# Altium schematic sheet BSU_Sensing.SchDoc: Sensing
size A4; Sub Team: EEE; Organization: PERT; SheetNumber: 5; SheetTotal: 8
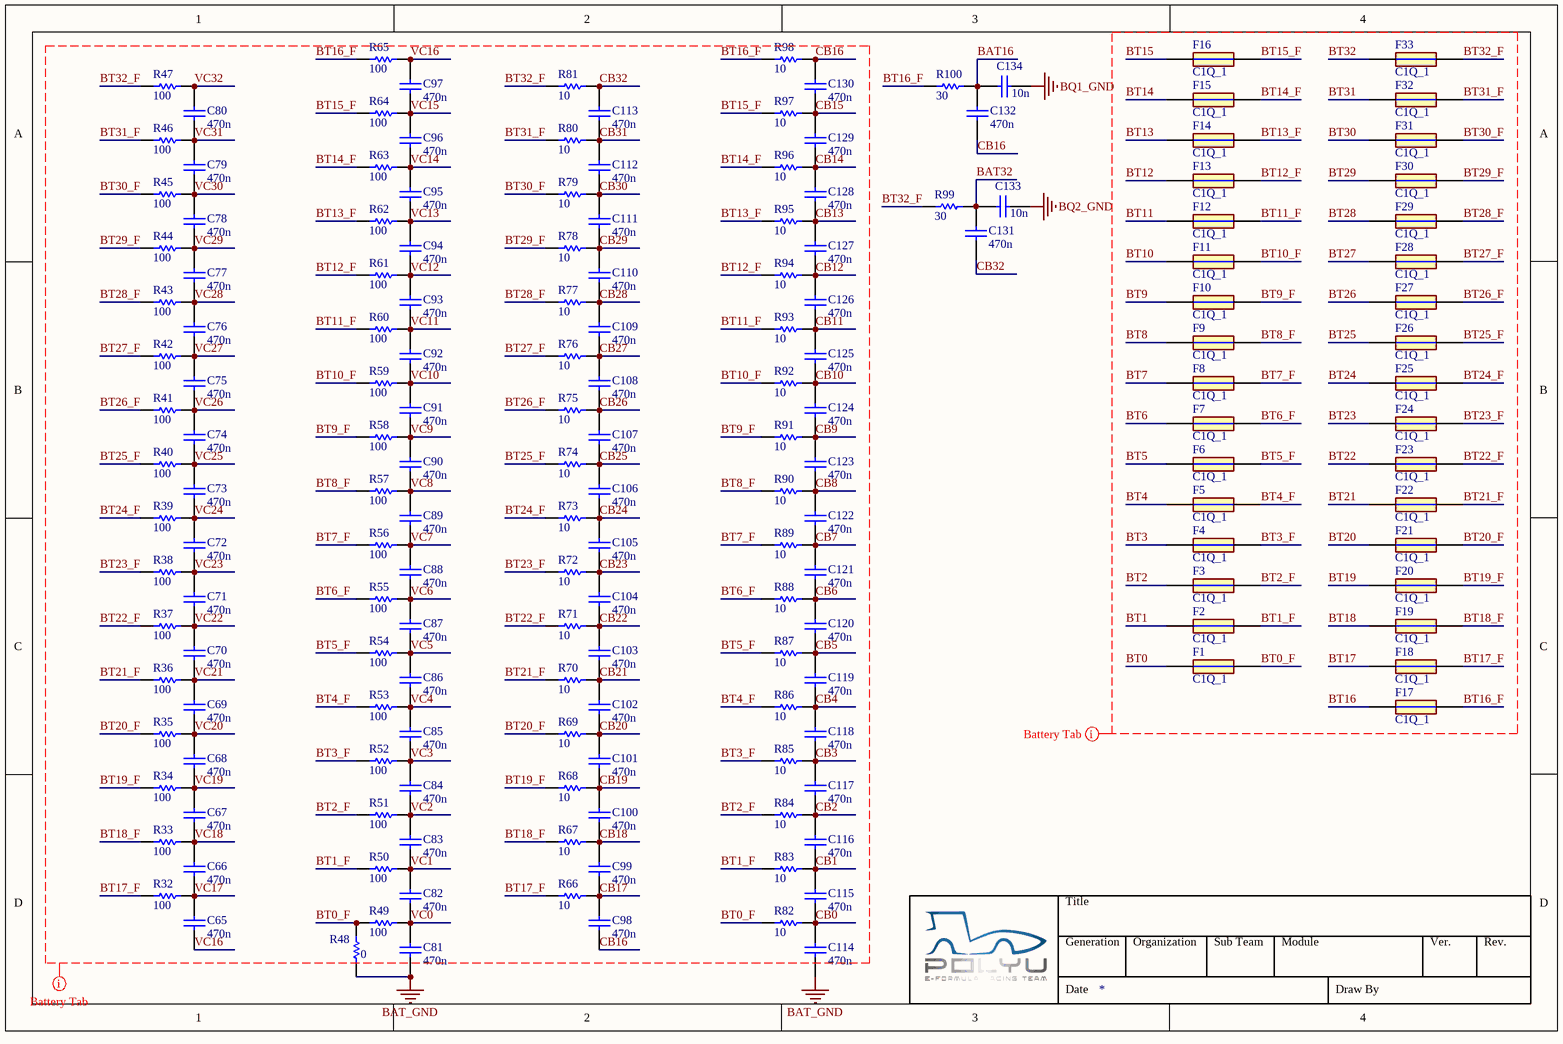
[diagram p0: BSU_Sensing.SchDoc]

## Parts
C65  470n  [0603_SMD_C]
C66  470n  [0603_SMD_C]
C67  470n  [0603_SMD_C]
C68  470n  [0603_SMD_C]
C69  470n  [0603_SMD_C]
C70  470n  [0603_SMD_C]
C71  470n  [0603_SMD_C]
C72  470n  [0603_SMD_C]
C73  470n  [0603_SMD_C]
C74  470n  [0603_SMD_C]
C75  470n  [0603_SMD_C]
C76  470n  [0603_SMD_C]
C77  470n  [0603_SMD_C]
C78  470n  [0603_SMD_C]
C79  470n  [0603_SMD_C]
C80  470n  [0603_SMD_C]
C81  470n  [0603_SMD_C]
C82  470n  [0603_SMD_C]
C83  470n  [0603_SMD_C]
C84  470n  [0603_SMD_C]
C85  470n  [0603_SMD_C]
C86  470n  [0603_SMD_C]
C87  470n  [0603_SMD_C]
C88  470n  [0603_SMD_C]
C89  470n  [0603_SMD_C]
C90  470n  [0603_SMD_C]
C91  470n  [0603_SMD_C]
C92  470n  [0603_SMD_C]
C93  470n  [0603_SMD_C]
C94  470n  [0603_SMD_C]
C95  470n  [0603_SMD_C]
C96  470n  [0603_SMD_C]
C97  470n  [0603_SMD_C]
C98  470n  [0603_SMD_C]
C99  470n  [0603_SMD_C]
C100  470n  [0603_SMD_C]
C101  470n  [0603_SMD_C]
C102  470n  [0603_SMD_C]
C103  470n  [0603_SMD_C]
C104  470n  [0603_SMD_C]
C105  470n  [0603_SMD_C]
C106  470n  [0603_SMD_C]
C107  470n  [0603_SMD_C]
C108  470n  [0603_SMD_C]
C109  470n  [0603_SMD_C]
C110  470n  [0603_SMD_C]
C111  470n  [0603_SMD_C]
C112  470n  [0603_SMD_C]
C113  470n  [0603_SMD_C]
C114  470n  [0603_SMD_C]
C115  470n  [0603_SMD_C]
C116  470n  [0603_SMD_C]
C117  470n  [0603_SMD_C]
C118  470n  [0603_SMD_C]
C119  470n  [0603_SMD_C]
C120  470n  [0603_SMD_C]
C121  470n  [0603_SMD_C]
C122  470n  [0603_SMD_C]
C123  470n  [0603_SMD_C]
C124  470n  [0603_SMD_C]
C125  470n  [0603_SMD_C]
C126  470n  [0603_SMD_C]
C127  470n  [0603_SMD_C]
C128  470n  [0603_SMD_C]
C129  470n  [0603_SMD_C]
C130  470n  [0603_SMD_C]
C131  470n  [0805_SMD_C]
C132  470n  [0805_SMD_C]
C133  10n  [0805_SMD_C]
C134  10n  [0805_SMD_C]
F1  C1Q_1  [1206_C1Q]
F2  C1Q_1  [1206_C1Q]
F3  C1Q_1  [1206_C1Q]
F4  C1Q_1  [1206_C1Q]
F5  C1Q_1  [1206_C1Q]
F6  C1Q_1  [1206_C1Q]
F7  C1Q_1  [1206_C1Q]
F8  C1Q_1  [1206_C1Q]
F9  C1Q_1  [1206_C1Q]
F10  C1Q_1  [1206_C1Q]
F11  C1Q_1  [1206_C1Q]
F12  C1Q_1  [1206_C1Q]
F13  C1Q_1  [1206_C1Q]
F14  C1Q_1  [1206_C1Q]
F15  C1Q_1  [1206_C1Q]
F16  C1Q_1  [1206_C1Q]
F17  C1Q_1  [1206_C1Q]
F18  C1Q_1  [1206_C1Q]
F19  C1Q_1  [1206_C1Q]
F20  C1Q_1  [1206_C1Q]
F21  C1Q_1  [1206_C1Q]
F22  C1Q_1  [1206_C1Q]
F23  C1Q_1  [1206_C1Q]
F24  C1Q_1  [1206_C1Q]
F25  C1Q_1  [1206_C1Q]
F26  C1Q_1  [1206_C1Q]
F27  C1Q_1  [1206_C1Q]
F28  C1Q_1  [1206_C1Q]
F29  C1Q_1  [1206_C1Q]
F30  C1Q_1  [1206_C1Q]
F31  C1Q_1  [1206_C1Q]
F32  C1Q_1  [1206_C1Q]
F33  C1Q_1  [1206_C1Q]
R32  100  [0603_SMD_R]
R33  100  [0603_SMD_R]
R34  100  [0603_SMD_R]
R35  100  [0603_SMD_R]
R36  100  [0603_SMD_R]
R37  100  [0603_SMD_R]
R38  100  [0603_SMD_R]
R39  100  [0603_SMD_R]
R40  100  [0603_SMD_R]
R41  100  [0603_SMD_R]
R42  100  [0603_SMD_R]
R43  100  [0603_SMD_R]
R44  100  [0603_SMD_R]
R45  100  [0603_SMD_R]
R46  100  [0603_SMD_R]
R47  100  [0603_SMD_R]
R48  0  [1210_SMD_R]
R49  100  [0603_SMD_R]
R50  100  [0603_SMD_R]
R51  100  [0603_SMD_R]
R52  100  [0603_SMD_R]
R53  100  [0603_SMD_R]
R54  100  [0603_SMD_R]
R55  100  [0603_SMD_R]
R56  100  [0603_SMD_R]
R57  100  [0603_SMD_R]
R58  100  [0603_SMD_R]
R59  100  [0603_SMD_R]
R60  100  [0603_SMD_R]
R61  100  [0603_SMD_R]
R62  100  [0603_SMD_R]
R63  100  [0603_SMD_R]
R64  100  [0603_SMD_R]
R65  100  [0603_SMD_R]
R66  10  [1210_SMD_R]
R67  10  [1210_SMD_R]
R68  10  [1210_SMD_R]
R69  10  [1210_SMD_R]
R70  10  [1210_SMD_R]
R71  10  [1210_SMD_R]
R72  10  [1210_SMD_R]
R73  10  [1210_SMD_R]
R74  10  [1210_SMD_R]
R75  10  [1210_SMD_R]
R76  10  [1210_SMD_R]
R77  10  [1210_SMD_R]
R78  10  [1210_SMD_R]
R79  10  [1210_SMD_R]
R80  10  [1210_SMD_R]
R81  10  [1210_SMD_R]
R82  10  [1210_SMD_R]
R83  10  [1210_SMD_R]
R84  10  [1210_SMD_R]
R85  10  [1210_SMD_R]
R86  10  [1210_SMD_R]
R87  10  [1210_SMD_R]
R88  10  [1210_SMD_R]
R89  10  [1210_SMD_R]
R90  10  [1210_SMD_R]
R91  10  [1210_SMD_R]
R92  10  [1210_SMD_R]
R93  10  [1210_SMD_R]
R94  10  [1210_SMD_R]
R95  10  [1210_SMD_R]
R96  10  [1210_SMD_R]
R97  10  [1210_SMD_R]
R98  10  [1210_SMD_R]
R99  30  [0805_SMD_R]
R100  30  [0805_SMD_R]

## Nets
BAT_GND: C81.2 C114.1 R48.1
BQ1_GND: C134.1
BQ2_GND: C133.1
BAT16: C132.2 C134.2 R100.2
BAT32: C131.2 C133.2 R99.2
BT0: F1.1
BT0_F: F1.2 R48.2 R49.1 R82.1
BT1: F2.1
BT1_F: F2.2 R50.1 R83.1
BT2: F3.1
BT2_F: F3.2 R51.1 R84.1
BT3: F4.1
BT3_F: F4.2 R52.1 R85.1
BT4: F5.1
BT4_F: F5.2 R53.1 R86.1
BT5: F6.1
BT5_F: F6.2 R54.1 R87.1
BT6: F7.1
BT6_F: F7.2 R55.1 R88.1
BT7: F8.1
BT7_F: F8.2 R56.1 R89.1
BT8: F9.1
BT8_F: F9.2 R57.1 R90.1
BT9: F10.1
BT9_F: F10.2 R58.1 R91.1
BT10: F11.1
BT10_F: F11.2 R59.1 R92.1
BT11: F12.1
BT11_F: F12.2 R60.1 R93.1
BT12: F13.1
BT12_F: F13.2 R61.1 R94.1
BT13: F14.1
BT13_F: F14.2 R62.1 R95.1
BT14: F15.1
BT14_F: F15.2 R63.1 R96.1
BT15: F16.1
BT15_F: F16.2 R64.1 R97.1
BT16: F17.1
BT16_F: F17.2 R65.1 R98.1 R100.1
BT17: F18.1
BT17_F: F18.2 R32.1 R66.1
BT18: F19.1
BT18_F: F19.2 R33.1 R67.1
BT19: F20.1
BT19_F: F20.2 R34.1 R68.1
BT20: F21.1
BT20_F: F21.2 R35.1 R69.1
BT21: F22.1
BT21_F: F22.2 R36.1 R70.1
BT22: F23.1
BT22_F: F23.2 R37.1 R71.1
BT23: F24.1
BT23_F: F24.2 R38.1 R72.1
BT24: F25.1
BT24_F: F25.2 R39.1 R73.1
BT25: F26.1
BT25_F: F26.2 R40.1 R74.1
BT26: F27.1
BT26_F: F27.2 R41.1 R75.1
BT27: F28.1
BT27_F: F28.2 R42.1 R76.1
BT28: F29.1
BT28_F: F29.2 R43.1 R77.1
BT29: F30.1
BT29_F: F30.2 R44.1 R78.1
BT30: F31.1
BT30_F: F31.2 R45.1 R79.1
BT31: F32.1
BT31_F: F32.2 R46.1 R80.1
BT32: F33.1
BT32_F: F33.2 R47.1 R81.1 R99.1
CB0: C114.2 C115.1 R82.2
CB1: C115.2 C116.1 R83.2
CB2: C116.2 C117.1 R84.2
CB3: C117.2 C118.1 R85.2
CB4: C118.2 C119.1 R86.2
CB5: C119.2 C120.1 R87.2
CB6: C120.2 C121.1 R88.2
CB7: C121.2 C122.1 R89.2
CB8: C122.2 C123.1 R90.2
CB9: C123.2 C124.1 R91.2
CB10: C124.2 C125.1 R92.2
CB11: C125.2 C126.1 R93.2
CB12: C126.2 C127.1 R94.2
CB13: C127.2 C128.1 R95.2
CB14: C128.2 C129.1 R96.2
CB15: C129.2 C130.1 R97.2
CB16: C98.1 C130.2 C132.1 R98.2
CB17: C98.2 C99.1 R66.2
CB18: C99.2 C100.1 R67.2
CB19: C100.2 C101.1 R68.2
CB20: C101.2 C102.1 R69.2
CB21: C102.2 C103.1 R70.2
CB22: C103.2 C104.1 R71.2
CB23: C104.2 C105.1 R72.2
CB24: C105.2 C106.1 R73.2
CB25: C106.2 C107.1 R74.2
CB26: C107.2 C108.1 R75.2
CB27: C108.2 C109.1 R76.2
CB28: C109.2 C110.1 R77.2
CB29: C110.2 C111.1 R78.2
CB30: C111.2 C112.1 R79.2
CB31: C112.2 C113.1 R80.2
CB32: C113.2 C131.1 R81.2
VC0: C81.1 C82.1 R49.2
VC1: C82.2 C83.1 R50.2
VC2: C83.2 C84.1 R51.2
VC3: C84.2 C85.1 R52.2
VC4: C85.2 C86.1 R53.2
VC5: C86.2 C87.1 R54.2
VC6: C87.2 C88.1 R55.2
VC7: C88.2 C89.1 R56.2
VC8: C89.2 C90.1 R57.2
VC9: C90.2 C91.1 R58.2
VC10: C91.2 C92.1 R59.2
VC11: C92.2 C93.1 R60.2
VC12: C93.2 C94.1 R61.2
VC13: C94.2 C95.1 R62.2
VC14: C95.2 C96.1 R63.2
VC15: C96.2 C97.1 R64.2
VC16: C65.1 C97.2 R65.2
VC17: C65.2 C66.1 R32.2
VC18: C66.2 C67.1 R33.2
VC19: C67.2 C68.1 R34.2
VC20: C68.2 C69.1 R35.2
VC21: C69.2 C70.1 R36.2
VC22: C70.2 C71.1 R37.2
VC23: C71.2 C72.1 R38.2
VC24: C72.2 C73.1 R39.2
VC25: C73.2 C74.1 R40.2
VC26: C74.2 C75.1 R41.2
VC27: C75.2 C76.1 R42.2
VC28: C76.2 C77.1 R43.2
VC29: C77.2 C78.1 R44.2
VC30: C78.2 C79.1 R45.2
VC31: C79.2 C80.1 R46.2
VC32: C80.2 R47.2

## Layout directives
net class BT: BT0, BT0_F, BT1, BT1_F, BT2, BT2_F, BT3, BT3_F, BT4, BT4_F, BT5, BT5_F, BT6, BT6_F, BT7, BT7_F, BT8, BT8_F, BT9, BT9_F, BT10, BT10_F, BT11, BT11_F, BT12, BT12_F, BT13, BT13_F, BT14, BT14_F, BT15, BT15_F, BT16, BT16_F, BT17, BT17_F, BT18, BT18_F, BT19, BT19_F, BT20, BT20_F, BT21, BT21_F, BT22, BT22_F, BT23, BT23_F, BT24, BT24_F, BT25, BT25_F, BT26, BT26_F, BT27, BT27_F, BT28, BT28_F, BT29, BT29_F, BT30, BT30_F, BT31, BT31_F, BT32, BT32_F, CB0, CB1, CB2, CB3, CB4, CB5, CB6, CB7, CB8, CB9, CB10, CB11, CB12, CB13, CB14, CB15, CB16, CB17, CB18, CB19, CB20, CB21, CB22, CB23, CB24, CB25, CB26, CB27, CB28, CB29, CB30, CB31, CB32, VC0, VC1, VC2, VC3, VC4, VC5, VC6, VC7, VC8, VC9, VC10, VC11, VC12, VC13, VC14, VC15, VC16, VC17, VC18, VC19, VC20, VC21, VC22, VC23, VC24, VC25, VC26, VC27, VC28, VC29, VC30, VC31, VC32

## Notes on the sheet
- Title
- Generation
- Organization
- Sub Team
- Module
- Ver.
- Rev.
- Date
- Draw By

## Library data of the parts
C65-C130 = 0603_SMD_Capacitor: 0603 SMD Capacitor; Voltage Rating: 16VDC; Tolerance: *; Dielectric: *; Value: 470n
C131-C134 = 0805_SMD_Capacitor: 0805 SMD Capacitor; Voltage Rating: 100VDC; Tolerance: *; Dielectric: *
  C131 C132: Value: 470n
  C133 C134: Value: 10n
F1-F33 = Bel Fuse 1206 1A: T&R; Manufacturer_Name: Bel; Manufacturer_Part_Number: C1Q 1; Geometry.Height: 0.78mm; Mouser Part Number: 530-C1Q1; Mouser Price/Stock: *; Datasheet Link: https://www.mouser.com/datasheet/2/643/ds-CP-c1q-series-1313102.pdf
R32-R47 R49-R65 = 0603_SMD_Resistor: 0603 SMD Resistor; Tolerance: *; Power Rating: *; Temperature Coefficient: *; Value: 100
R48 R66-R98 = 1210_SMD_Resistor: 1210 SMD Resistor; Tolerance: *; Power Rating: *; Temperature Coefficient: *
  R48: Value: 0
  R66-R98: Value: 10
R99 R100 = 0805_SMD_Resistor: 0805 SMD Resistor; Tolerance: *; Power Rating: *; Temperature Coefficient: *; Value: 30